# Altium schematic sheet Commutation.Board.SchDoc
size A4
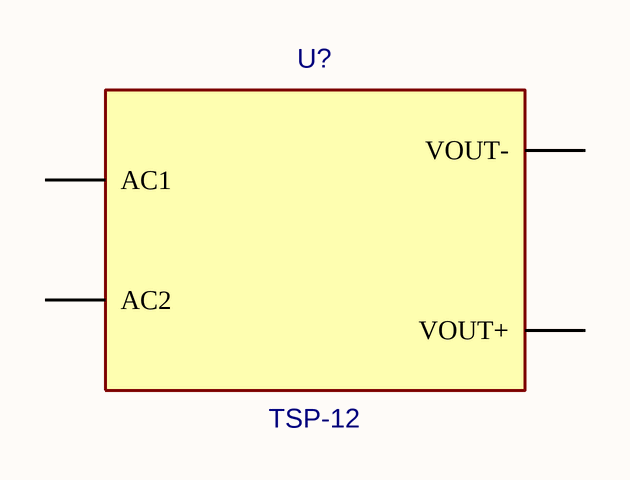
[diagram p0: Commutation.Board.SchDoc]

## Parts
U?  TSP-12  [TSP-12]

## Nets

Not connected (* = marked no-connect by the designer): U? P$1(AC1) P$2(AC2) P$3(VOUT-) P$4(VOUT+)